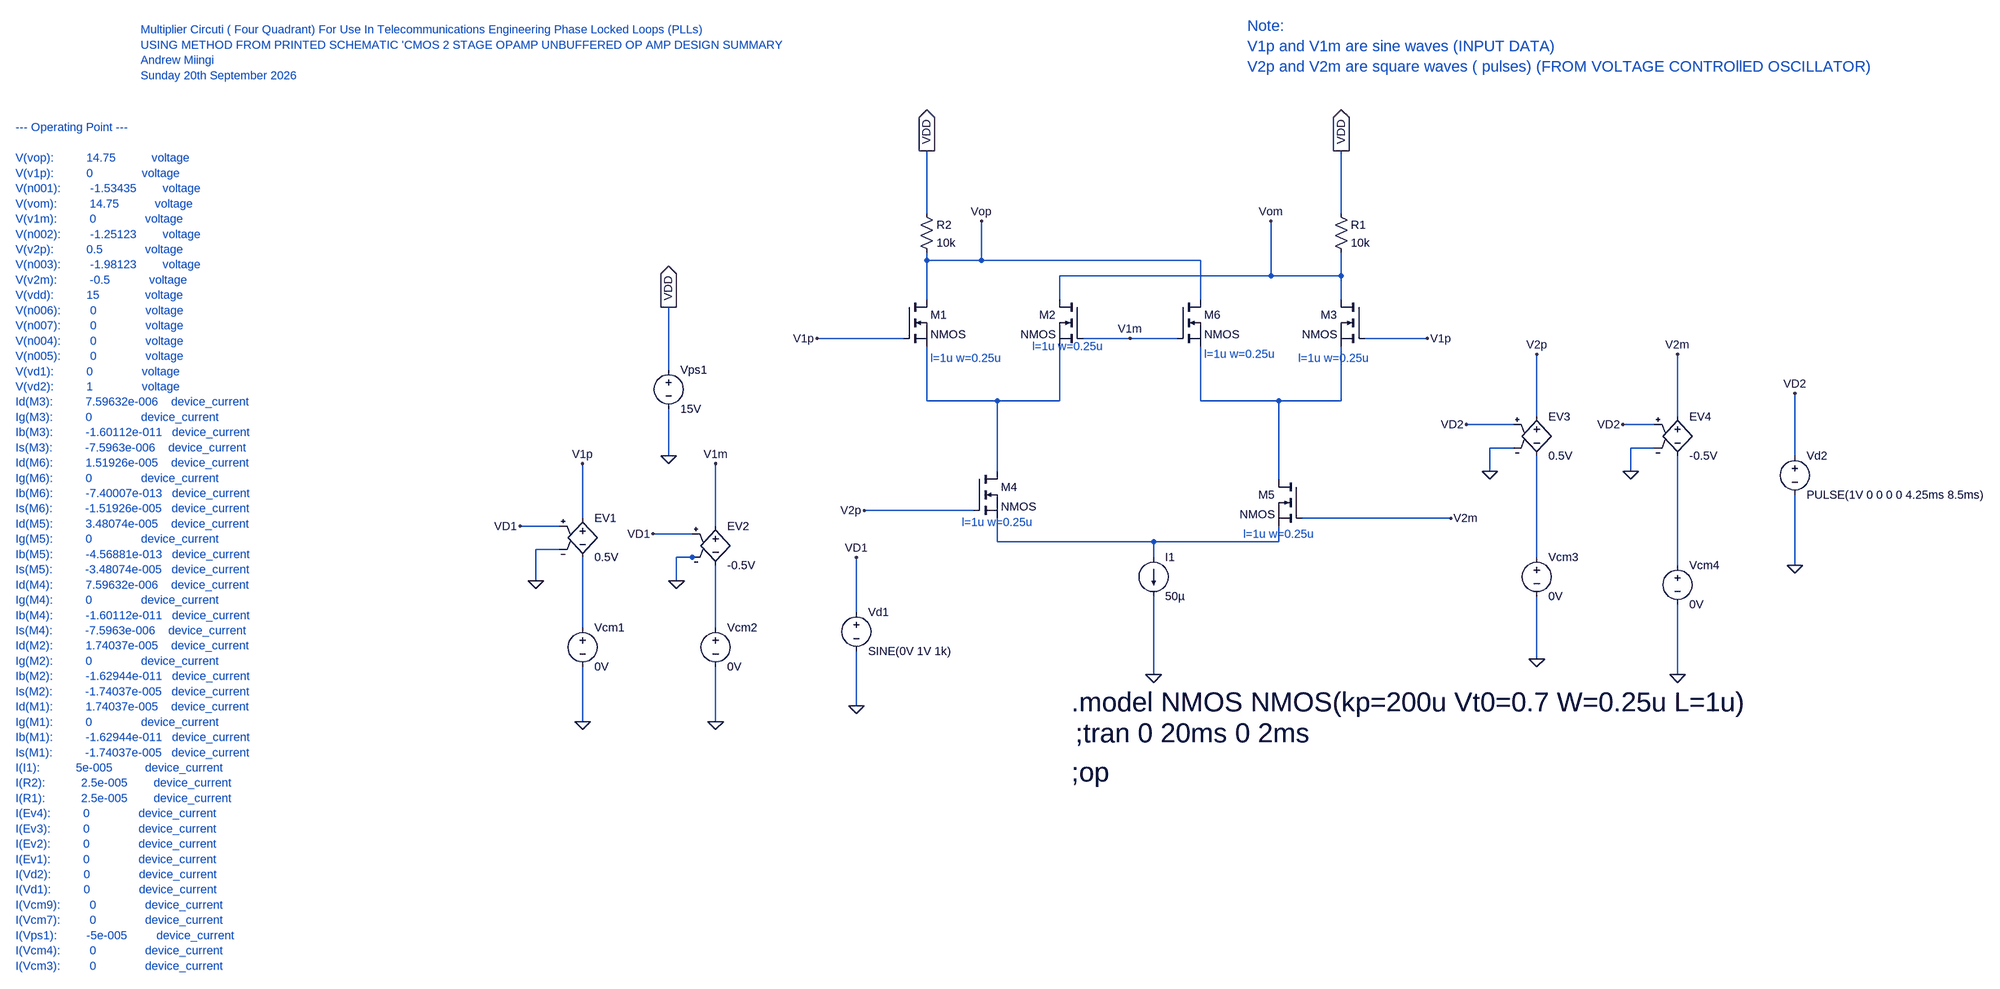
[diagram p0: schematic Multiplier_Circuit_(4_Quadrant)_For_Use_In_Telecommunications_Phase_Locked_Loop(USING_METHOD_FROM_UNBUFFERED_CMOS_OPAMP_19TH_SEP_2026.asc]
Multiplier_Circuit_(4_Quadrant)_For_Use_In_Telecommunications_Phase_Locked_Loop(USING_METHOD_FROM_UNBUFFERED_CMOS_OPAMP_19TH_SEP_2026.asc, the LTspice schematic file:
Version 4
SHEET 1 2872 1252
WIRE 688 -128 688 -256
WIRE 1536 -128 1536 -256
WIRE 688 -32 688 -48
WIRE 800 -32 800 -112
WIRE 800 -32 688 -32
WIRE 1248 -32 800 -32
WIRE 1392 0 1392 -112
WIRE 1392 0 960 0
WIRE 1536 0 1536 -48
WIRE 1536 0 1392 0
WIRE 688 48 688 -32
WIRE 960 48 960 0
WIRE 1248 48 1248 -32
WIRE 1536 48 1536 0
WIRE 640 128 464 128
WIRE 1104 128 1008 128
WIRE 1200 128 1104 128
WIRE 1712 128 1584 128
WIRE 160 192 160 64
WIRE 688 256 688 144
WIRE 832 256 688 256
WIRE 960 256 960 144
WIRE 960 256 832 256
WIRE 1248 256 1248 144
WIRE 1408 256 1248 256
WIRE 1536 256 1536 144
WIRE 1536 256 1408 256
WIRE 1936 288 1936 160
WIRE 2224 288 2224 160
WIRE 1888 304 1792 304
WIRE 2176 304 2112 304
WIRE 1888 352 1840 352
WIRE 2176 352 2128 352
WIRE 160 368 160 272
WIRE 2464 368 2464 240
WIRE 832 400 832 256
WIRE 1840 400 1840 352
WIRE 2128 400 2128 352
WIRE 1408 416 1408 256
WIRE 784 480 560 480
WIRE -16 496 -16 384
WIRE 1760 496 1456 496
WIRE -64 512 -144 512
WIRE 256 512 256 384
WIRE 208 528 128 528
WIRE 832 544 832 496
WIRE 1152 544 832 544
WIRE 1408 544 1408 512
WIRE 1408 544 1152 544
WIRE -64 560 -112 560
WIRE 208 576 176 576
WIRE 224 576 208 576
WIRE 1152 576 1152 544
WIRE 1936 576 1936 368
WIRE 2224 592 2224 368
WIRE 2464 592 2464 448
WIRE -112 624 -112 560
WIRE 176 624 176 576
WIRE 544 688 544 576
WIRE -16 720 -16 576
WIRE 256 720 256 592
WIRE 1936 784 1936 656
WIRE 1152 816 1152 656
WIRE 2224 816 2224 672
WIRE 544 880 544 768
WIRE -16 912 -16 800
WIRE 256 912 256 800
FLAG 1152 816 0
FLAG 688 -256 VDD
IOPIN 688 -256 Out
FLAG 1536 -256 VDD
IOPIN 1536 -256 Out
FLAG 800 -112 Vop
FLAG 1392 -112 Vom
FLAG 160 368 0
FLAG -16 912 0
FLAG 256 912 0
FLAG 464 128 V1p
FLAG 1712 128 V1p
FLAG 1104 128 V1m
FLAG -16 384 V1p
FLAG 256 384 V1m
FLAG 1936 784 0
FLAG 2224 816 0
FLAG 560 480 V2p
FLAG 1760 496 V2m
FLAG 1936 160 V2p
FLAG 2224 160 V2m
FLAG 160 64 VDD
IOPIN 160 64 Out
FLAG 544 880 0
FLAG 2464 592 0
FLAG 544 576 VD1
FLAG 2464 240 VD2
FLAG -144 512 VD1
FLAG 128 528 VD1
FLAG 1792 304 VD2
FLAG 2112 304 VD2
FLAG -112 624 0
FLAG 176 624 0
FLAG 1840 400 0
FLAG 2128 400 0
SYMBOL nmos 640 48 R0
SYMATTR InstName M1
SYMBOL nmos 1008 48 M0
SYMATTR InstName M2
SYMBOL nmos 1584 48 M0
SYMATTR InstName M3
SYMBOL nmos 784 400 R0
SYMATTR InstName M4
SYMBOL nmos 1456 416 M0
SYMATTR InstName M5
SYMBOL res 1520 -144 R0
SYMATTR InstName R1
SYMATTR Value 10k
SYMBOL res 672 -144 R0
SYMATTR InstName R2
SYMATTR Value 10k
SYMBOL current 1152 576 R0
SYMATTR InstName I1
SYMATTR Value 50µ
SYMBOL nmos 1200 48 R0
SYMATTR InstName M6
SYMBOL voltage -16 704 R0
SYMATTR InstName Vcm1
SYMATTR Value 0V
SYMBOL voltage 256 704 R0
WINDOW 123 0 0 Left 0
WINDOW 39 0 0 Left 0
SYMATTR InstName Vcm2
SYMATTR Value 0V
SYMBOL voltage 160 176 R0
SYMATTR InstName Vps1
SYMATTR Value 15V
SYMBOL voltage 1936 560 R0
SYMATTR InstName Vcm3
SYMATTR Value 0V
SYMBOL voltage 2224 576 R0
SYMATTR InstName Vcm4
SYMATTR Value 0V
SYMBOL e -16 480 R0
SYMATTR InstName EV1
SYMATTR Value 0.5V
SYMBOL e 256 496 R0
SYMATTR InstName EV2
SYMATTR Value -0.5V
SYMBOL e 1936 272 R0
SYMATTR InstName EV3
SYMATTR Value 0.5V
SYMBOL e 2224 272 R0
SYMATTR InstName EV4
SYMATTR Value -0.5V
SYMBOL voltage 544 672 R0
WINDOW 123 0 0 Left 0
WINDOW 39 0 0 Left 0
SYMATTR InstName Vd1
SYMATTR Value SINE(0V 1V 1k)
SYMBOL voltage 2464 352 R0
WINDOW 123 0 0 Left 0
WINDOW 39 0 0 Left 0
SYMATTR InstName Vd2
SYMATTR Value PULSE(1V 0 0 0 0 4.25ms 8.5ms)
TEXT 696 168 Left 2 ;l=1u w=0.25u
TEXT 904 144 Left 2 ;l=1u w=0.25u
TEXT 1256 160 Left 2 ;l=1u w=0.25u
TEXT 1448 168 Left 2 ;l=1u w=0.25u
TEXT 984 872 Left 5 !.model NMOS NMOS(kp=200u Vt0=0.7 W=0.25u L=1u)
TEXT -920 -504 Left 2 ;Multiplier Circuti ( Four Quadrant) For Use In Telecommunications Engineering Phase Locked Loops (PLLs)\nUSING METHOD FROM PRINTED SCHEMATIC 'CMOS 2 STAGE OPAMP UNBUFFERED OP AMP DESIGN SUMMARY\nAndrew Miingi\nSunday 20th September 2026
TEXT 992 936 Left 5 !;tran 0 20ms 0 2ms
TEXT 984 1016 Left 5 !;op
TEXT 760 504 Left 2 ;l=1u w=0.25u
TEXT 1336 528 Left 2 ;l=1u w=0.25u
TEXT 1344 -512 Left 3 ;Note:\nV1p and V1m are sine waves (INPUT DATA)\nV2p and V2m are square waves ( pulses) (FROM VOLTAGE CONTROllED OSCILLATOR)
TEXT -1176 -304 Left 2 ;--- Operating Point ---\n \nV(vop):          14.75           voltage\nV(v1p):          0               voltage\nV(n001):         -1.53435        voltage\nV(vom):          14.75           voltage\nV(v1m):          0               voltage\nV(n002):         -1.25123        voltage\nV(v2p):          0.5             voltage\nV(n003):         -1.98123        voltage\nV(v2m):          -0.5            voltage\nV(vdd):          15              voltage\nV(n006):         0               voltage\nV(n007):         0               voltage\nV(n004):         0               voltage\nV(n005):         0               voltage\nV(vd1):          0               voltage\nV(vd2):          1               voltage\nId(M3):          7.59632e-006    device_current\nIg(M3):          0               device_current\nIb(M3):          -1.60112e-011   device_current\nIs(M3):          -7.5963e-006    device_current\nId(M6):          1.51926e-005    device_current\nIg(M6):          0               device_current\nIb(M6):          -7.40007e-013   device_current\nIs(M6):          -1.51926e-005   device_current\nId(M5):          3.48074e-005    device_current\nIg(M5):          0               device_current\nIb(M5):          -4.56881e-013   device_current\nIs(M5):          -3.48074e-005   device_current\nId(M4):          7.59632e-006    device_current\nIg(M4):          0               device_current\nIb(M4):          -1.60112e-011   device_current\nIs(M4):          -7.5963e-006    device_current\nId(M2):          1.74037e-005    device_current\nIg(M2):          0               device_current\nIb(M2):          -1.62944e-011   device_current\nIs(M2):          -1.74037e-005   device_current\nId(M1):          1.74037e-005    device_current\nIg(M1):          0               device_current\nIb(M1):          -1.62944e-011   device_current\nIs(M1):          -1.74037e-005   device_current\nI(I1):           5e-005          device_current\nI(R2):           2.5e-005        device_current\nI(R1):           2.5e-005        device_current\nI(Ev4):          0               device_current\nI(Ev3):          0               device_current\nI(Ev2):          0               device_current\nI(Ev1):          0               device_current\nI(Vd2):          0               device_current\nI(Vd1):          0               device_current\nI(Vcm9):         0               device_current\nI(Vcm7):         0               device_current\nI(Vps1):         -5e-005         device_current\nI(Vcm4):         0               device_current\nI(Vcm3):         0               device_current

The netlist it stands for:
* Multiplier_Circuit_(4_Quadrant)_For_Use_In_Telecommunications_Phase_Locked_Loop(USING_METHOD_FROM_UNBUFFERED_CMOS_OPAMP_19TH_SEP_2026.asc
M1 Vop V1p N001 N001 NMOS
M2 Vom V1m N001 N001 NMOS
M3 Vom V1p N002 N002 NMOS
M4 N001 V2p N003 N003 NMOS
M5 N002 V2m N003 N003 NMOS
R1 VDD Vom 10k
R2 VDD Vop 10k
I1 N003 0 50µ
M6 Vop V1m N002 N002 NMOS
Vcm1 N006 0 0V
Vcm2 N007 0 0V
Vps1 VDD 0 15V
Vcm3 N004 0 0V
Vcm4 N005 0 0V
EV1 V1p N006 VD1 0 0.5V
EV2 V1m N007 VD1 0 -0.5V
EV3 V2p N004 VD2 0 0.5V
EV4 V2m N005 VD2 0 -0.5V
Vd1 VD1 0 SINE(0V 1V 1k)
Vd2 VD2 0 PULSE(1V 0 0 0 0 4.25ms 8.5ms)
.model NMOS NMOS
.model PMOS PMOS
.lib standard.mos
* l=1u w=0.25u
* l=1u w=0.25u
* l=1u w=0.25u
* l=1u w=0.25u
.model NMOS NMOS(kp=200u Vt0=0.7 W=0.25u L=1u)
* Multiplier Circuti ( Four Quadrant) For Use In Telecommunications Engineering Phase Locked Loops (PLLs)
* USING METHOD FROM PRINTED SCHEMATIC 'CMOS 2 STAGE OPAMP UNBUFFERED OP AMP DESIGN SUMMARY
* Andrew Miingi
* Sunday 20th September 2026
;tran 0 20ms 0 2ms
;op
* l=1u w=0.25u
* l=1u w=0.25u
* Note:
* V1p and V1m are sine waves (INPUT DATA)
* V2p and V2m are square waves ( pulses) (FROM VOLTAGE CONTROllED OSCILLATOR)
* --- Operating Point ---
* V(vop):          14.75           voltage
* V(v1p):          0               voltage
* V(n001):         -1.53435        voltage
* V(vom):          14.75           voltage
* V(v1m):          0               voltage
* V(n002):         -1.25123        voltage
* V(v2p):          0.5             voltage
* V(n003):         -1.98123        voltage
* V(v2m):          -0.5            voltage
* V(vdd):          15              voltage
* V(n006):         0               voltage
* V(n007):         0               voltage
* V(n004):         0               voltage
* V(n005):         0               voltage
* V(vd1):          0               voltage
* V(vd2):          1               voltage
* Id(M3):          7.59632e-006    device_current
* Ig(M3):          0               device_current
* Ib(M3):          -1.60112e-011   device_current
* Is(M3):          -7.5963e-006    device_current
* Id(M6):          1.51926e-005    device_current
* Ig(M6):          0               device_current
* Ib(M6):          -7.40007e-013   device_current
* Is(M6):          -1.51926e-005   device_current
* Id(M5):          3.48074e-005    device_current
* Ig(M5):          0               device_current
* Ib(M5):          -4.56881e-013   device_current
* Is(M5):          -3.48074e-005   device_current
* Id(M4):          7.59632e-006    device_current
* Ig(M4):          0               device_current
* Ib(M4):          -1.60112e-011   device_current
* Is(M4):          -7.5963e-006    device_current
* Id(M2):          1.74037e-005    device_current
* Ig(M2):          0               device_current
* Ib(M2):          -1.62944e-011   device_current
* Is(M2):          -1.74037e-005   device_current
* Id(M1):          1.74037e-005    device_current
* Ig(M1):          0               device_current
* Ib(M1):          -1.62944e-011   device_current
* Is(M1):          -1.74037e-005   device_current
* I(I1):           5e-005          device_current
* I(R2):           2.5e-005        device_current
* I(R1):           2.5e-005        device_current
* I(Ev4):          0               device_current
* I(Ev3):          0               device_current
* I(Ev2):          0               device_current
* I(Ev1):          0               device_current
* I(Vd2):          0               device_current
* I(Vd1):          0               device_current
* I(Vcm9):         0               device_current
* I(Vcm7):         0               device_current
* I(Vps1):         -5e-005         device_current
* I(Vcm4):         0               device_current
* I(Vcm3):         0               device_current
.backanno
.end